# Altium schematic sheet Miscellaneous.SchDoc
size B; SheetNumber: 11; SheetTotal: 11
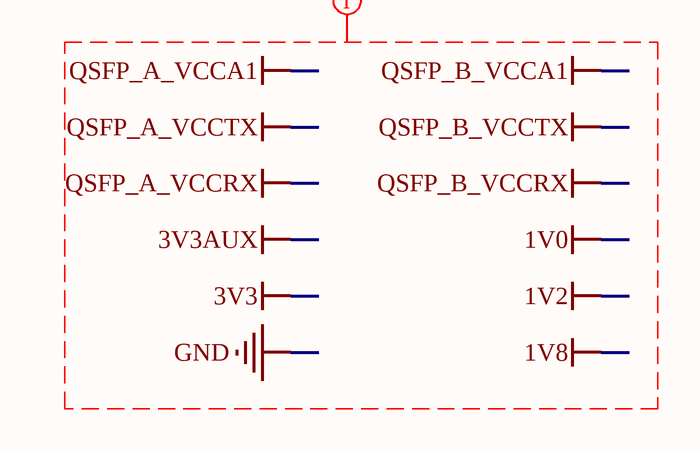
[diagram p0: Miscellaneous.SchDoc]

## Layout directives
net class Power_NC: 1V0, 1V2, 1V8, 3V3, 3V3AUX, GND, QSFP_A_VCCA1, QSFP_A_VCCRX, QSFP_A_VCCTX, QSFP_B_VCCA1, QSFP_B_VCCRX, QSFP_B_VCCTX